# EAGLE design bolt-on_template (EAGLE 9.6.2)
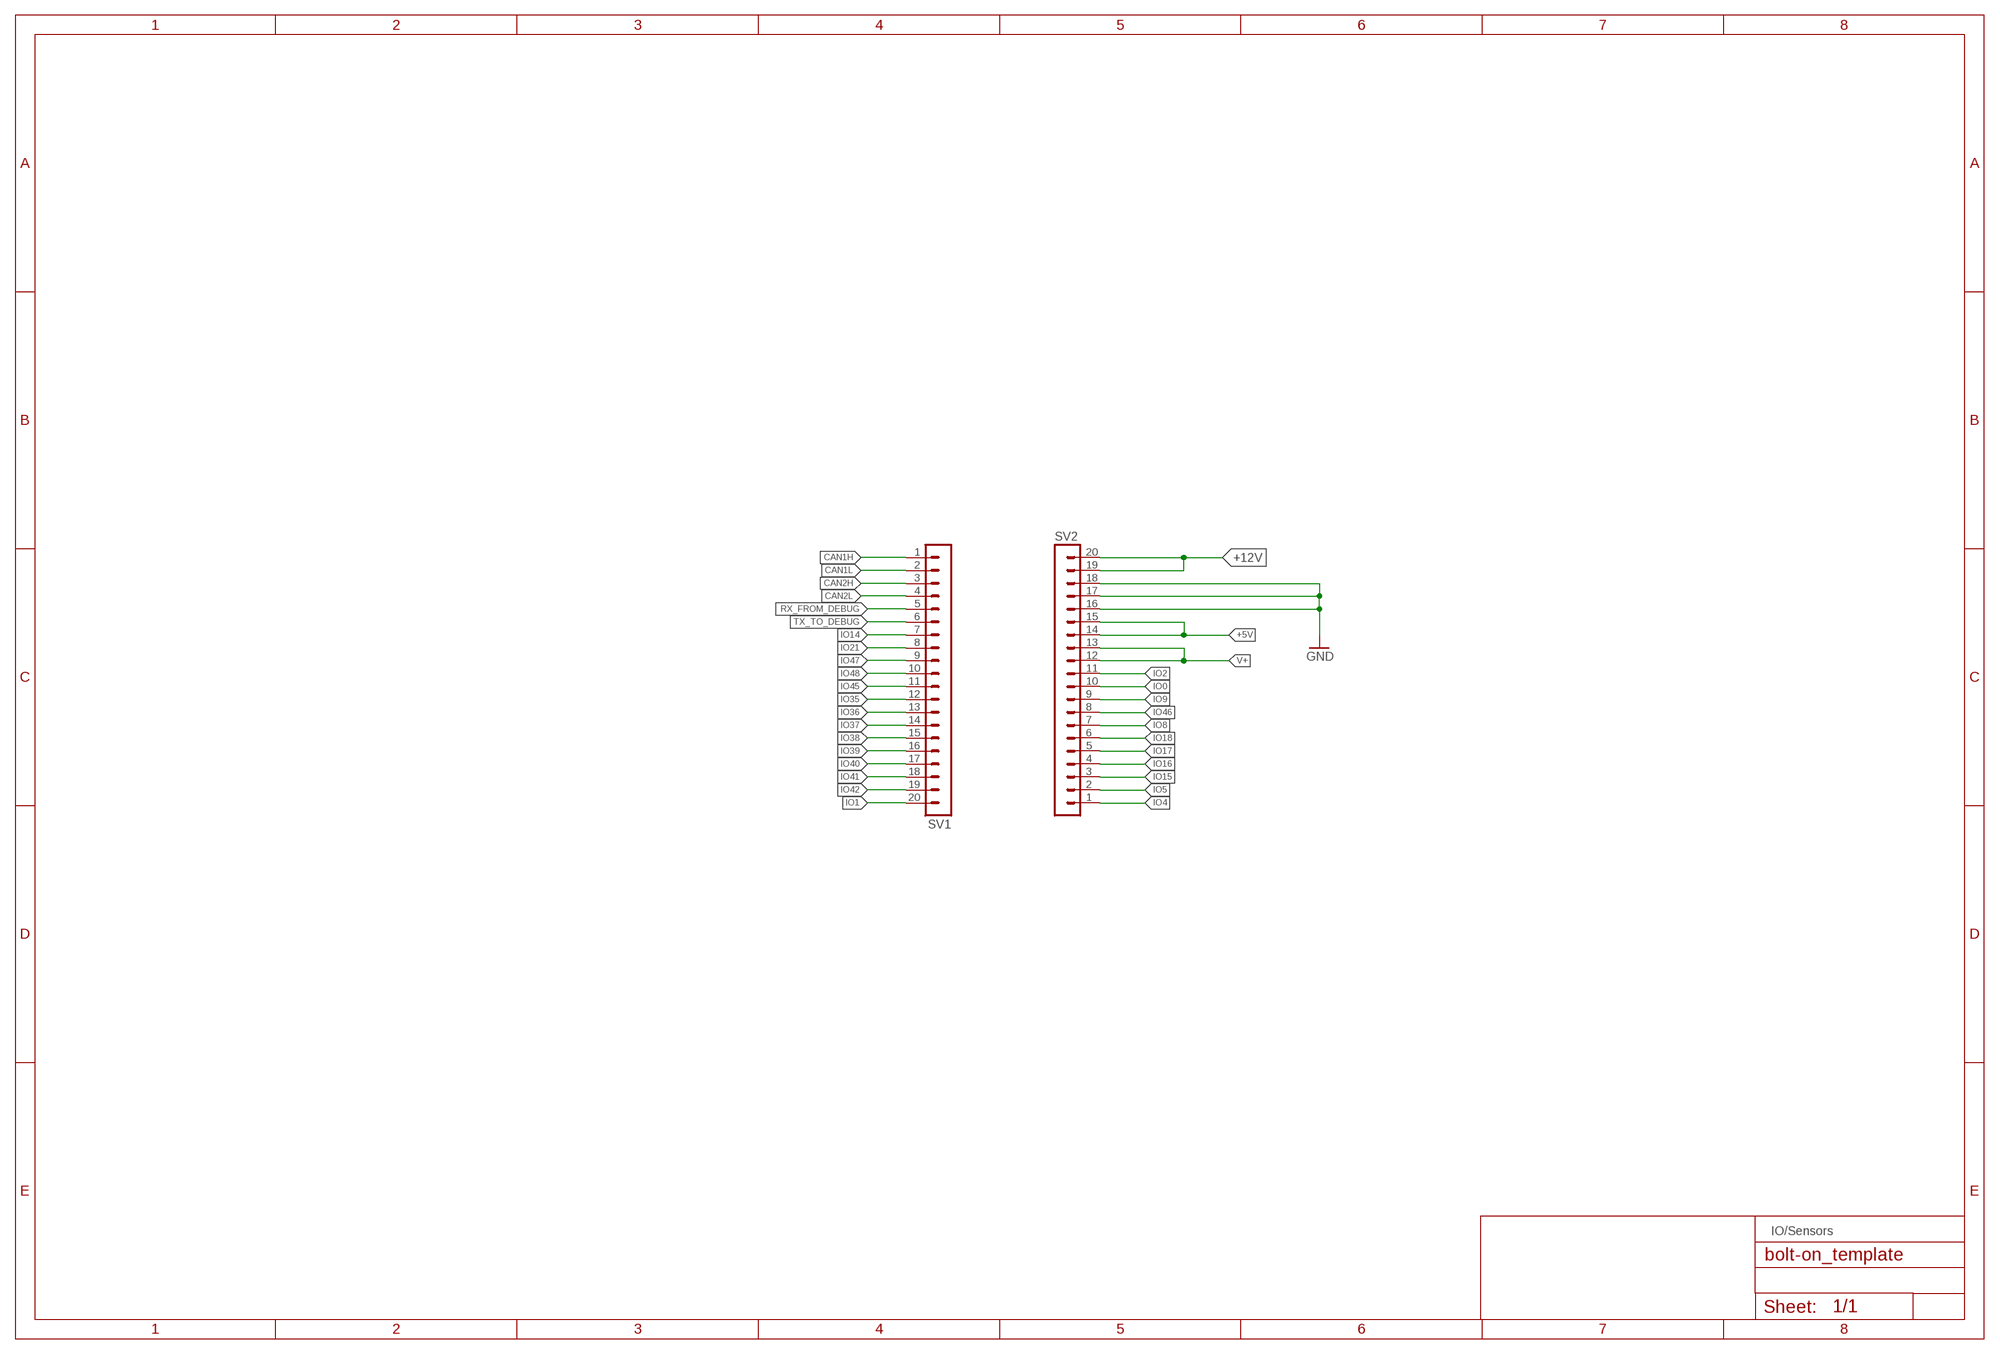
[diagram p0: schematic, sheet 1]

## Parts
SV1  MA20-1L  [MA20-1L]
SV2  MA20-1L  [MA20-1L]

## Nets
+5V: SV2.14 SV2.15
+12V: SV2.19 SV2.20
CAN1H: SV1.1
CAN1L: SV1.2
CAN2H: SV1.3
CAN2L: SV1.4
GND: SV2.16 SV2.17 SV2.18
IO0: SV2.10
IO1: SV1.20
IO2: SV2.11
IO4: SV2.1
IO5: SV2.2
IO8: SV2.7
IO9: SV2.9
IO14: SV1.7
IO15: SV2.3
IO16: SV2.4
IO17: SV2.5
IO18: SV2.6
IO21: SV1.8
IO35: SV1.12
IO36: SV1.13
IO37: SV1.14
IO38: SV1.15
IO39: SV1.16
IO40: SV1.17
IO41: SV1.18
IO42: SV1.19
IO45: SV1.11
IO46: SV2.8
IO47: SV1.9
IO48: SV1.10
RX_FROM_DEBUG: SV1.5
TX_TO_DEBUG: SV1.6
V+: SV2.12 SV2.13

## Notes on the sheet
- IO/Sensors

## Library data of the parts
SV1 SV2 = con-lstb:MA20-1L: PIN HEADER; OC_FARNELL: unknown; OC_NEWARK: unknown

## Board
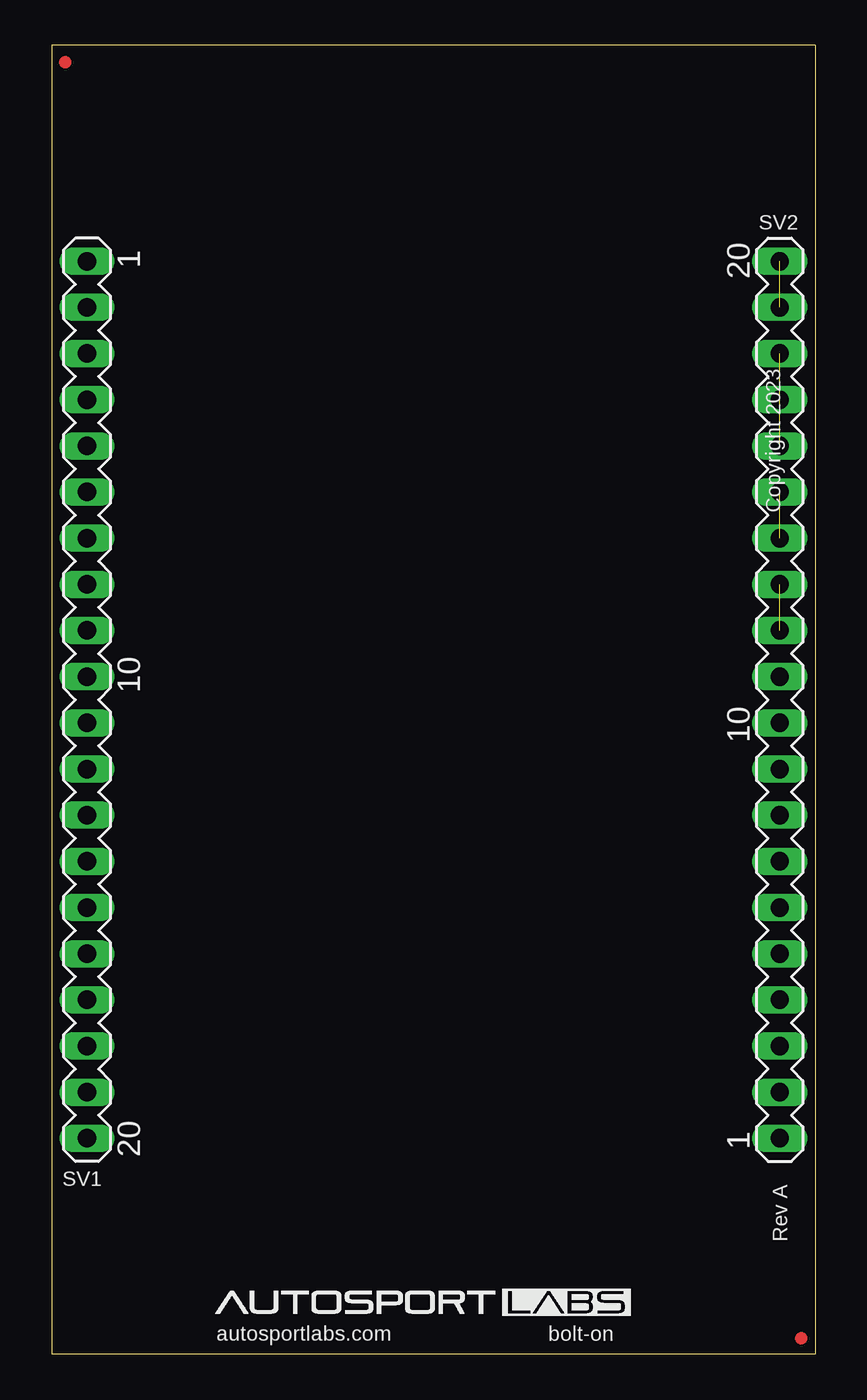
[diagram p1: board, top side]
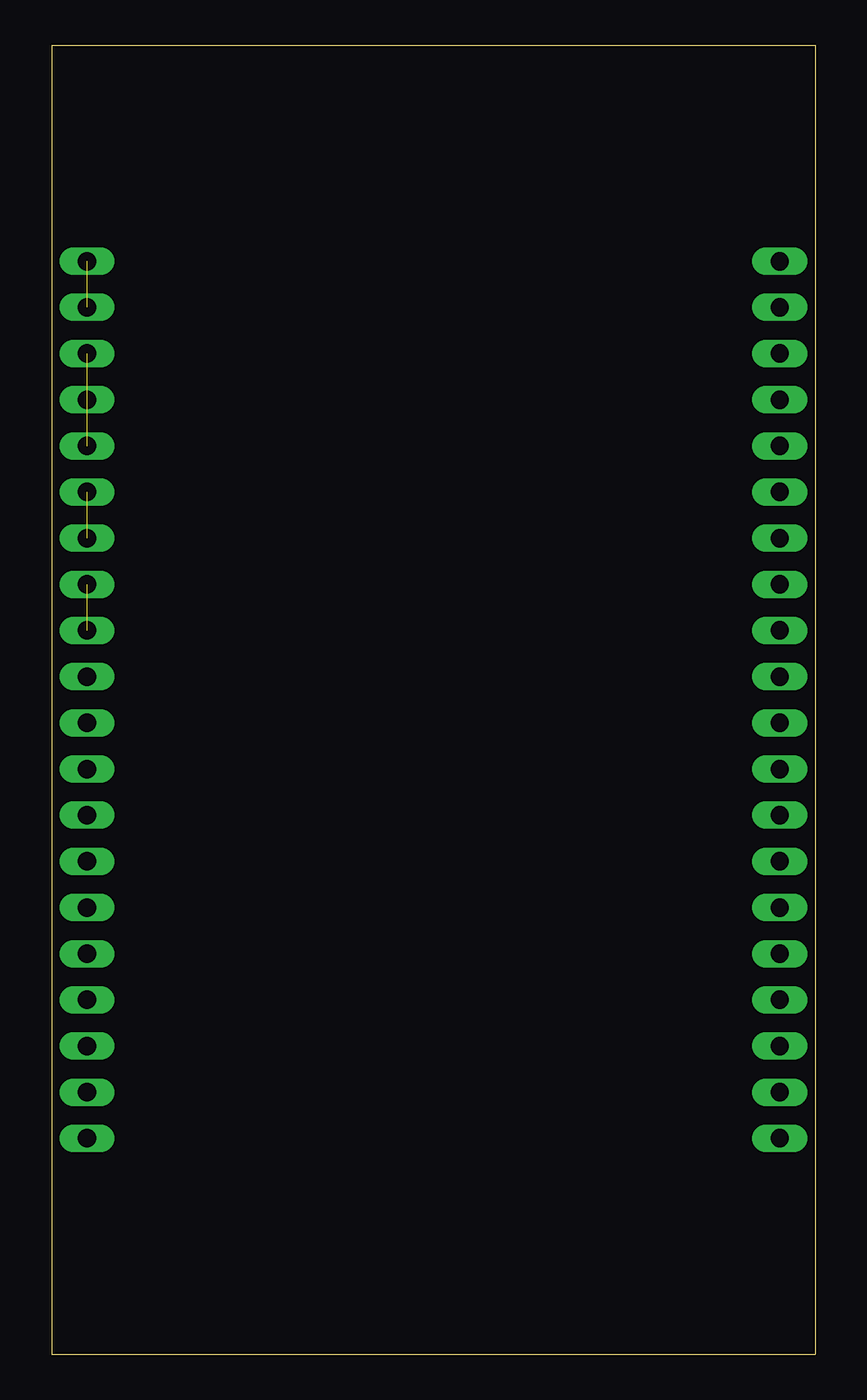
[diagram p2: board, bottom side, seen from below]

Size 42 x 72 mm. Coordinates in mm from the lower left corner, seen from the top.
Outline: 42,72 0,72 0,0 42,0 42,72
Copper layers (1+2*15+16): Top 0.0356mm / dielectric 1.5011mm / Route2 0.0356mm / dielectric 0.1499mm / Route15 0.0356mm / dielectric 0.2007mm / Bottom 0.0356mm
Design rules "LaenPCBOrder *": minimum track width 6mil, minimum drill 0.29971875mm, track to track 6mil, track to pad 6mil, pad to pad 6mil, via to via 6mil, smd to smd 6mil, copper to edge 10mil, drill to drill 6mil, minimum pad ring 7mil, minimum via ring 7mil, stop-mask expansion 3mil, vias tented up to drill 14mil, thermal gap 10mil

### Footprints (pad centres in the part's own frame; a part is rotated, then mirrored left to right if it is on the bottom)
MA20-1L = drill 1.016 long: 1 24.13,0; 2 21.59,0; 3 19.05,0; 4 16.51,0; 5 13.97,0; 6 11.43,0; 7 8.89,0; 8 6.35,0; 9 3.81,0; 10 1.27,0; 11 -1.27,0; 12 -3.81,0; 13 -6.35,0; 14 -8.89,0; 15 -11.43,0; 16 -13.97,0; 17 -16.51,0; 18 -19.05,0; 19 -21.59,0; 20 -24.13,0

### Placement (x,y rotation side)
SV1  1.95,36 90 top
SV2  40.05,36 270 top

### Tracks (layer width: path | path; a pad name or v marks a point on that pad's centre or on a via)
+5V  (1 unrouted)
+12V  (1 unrouted)
GND  (2 unrouted)
IO2
  Bottom 0.152: SV2.11 39.55,37.77
IO5
  Bottom 0.152: SV2.2 38.76,14.41
IO37
  Top 0.152: SV1.14
IO39
  Top 0.152: 3.32,22.03 SV1.16
IO40
  Top 0.152: 2.16,19.49 SV1.17
IO42
  Top 0.152: SV1.19 1.95,14.3
V+  (1 unrouted)
(copper drawn outside any net)
  shapes: Top circle x2

### Text on the board
tPlace: Copyright 2023 | Rev A | autosportlabs.com | bolt-on